# EAGLE design Xenium2019 (EAGLE 9.6.2)
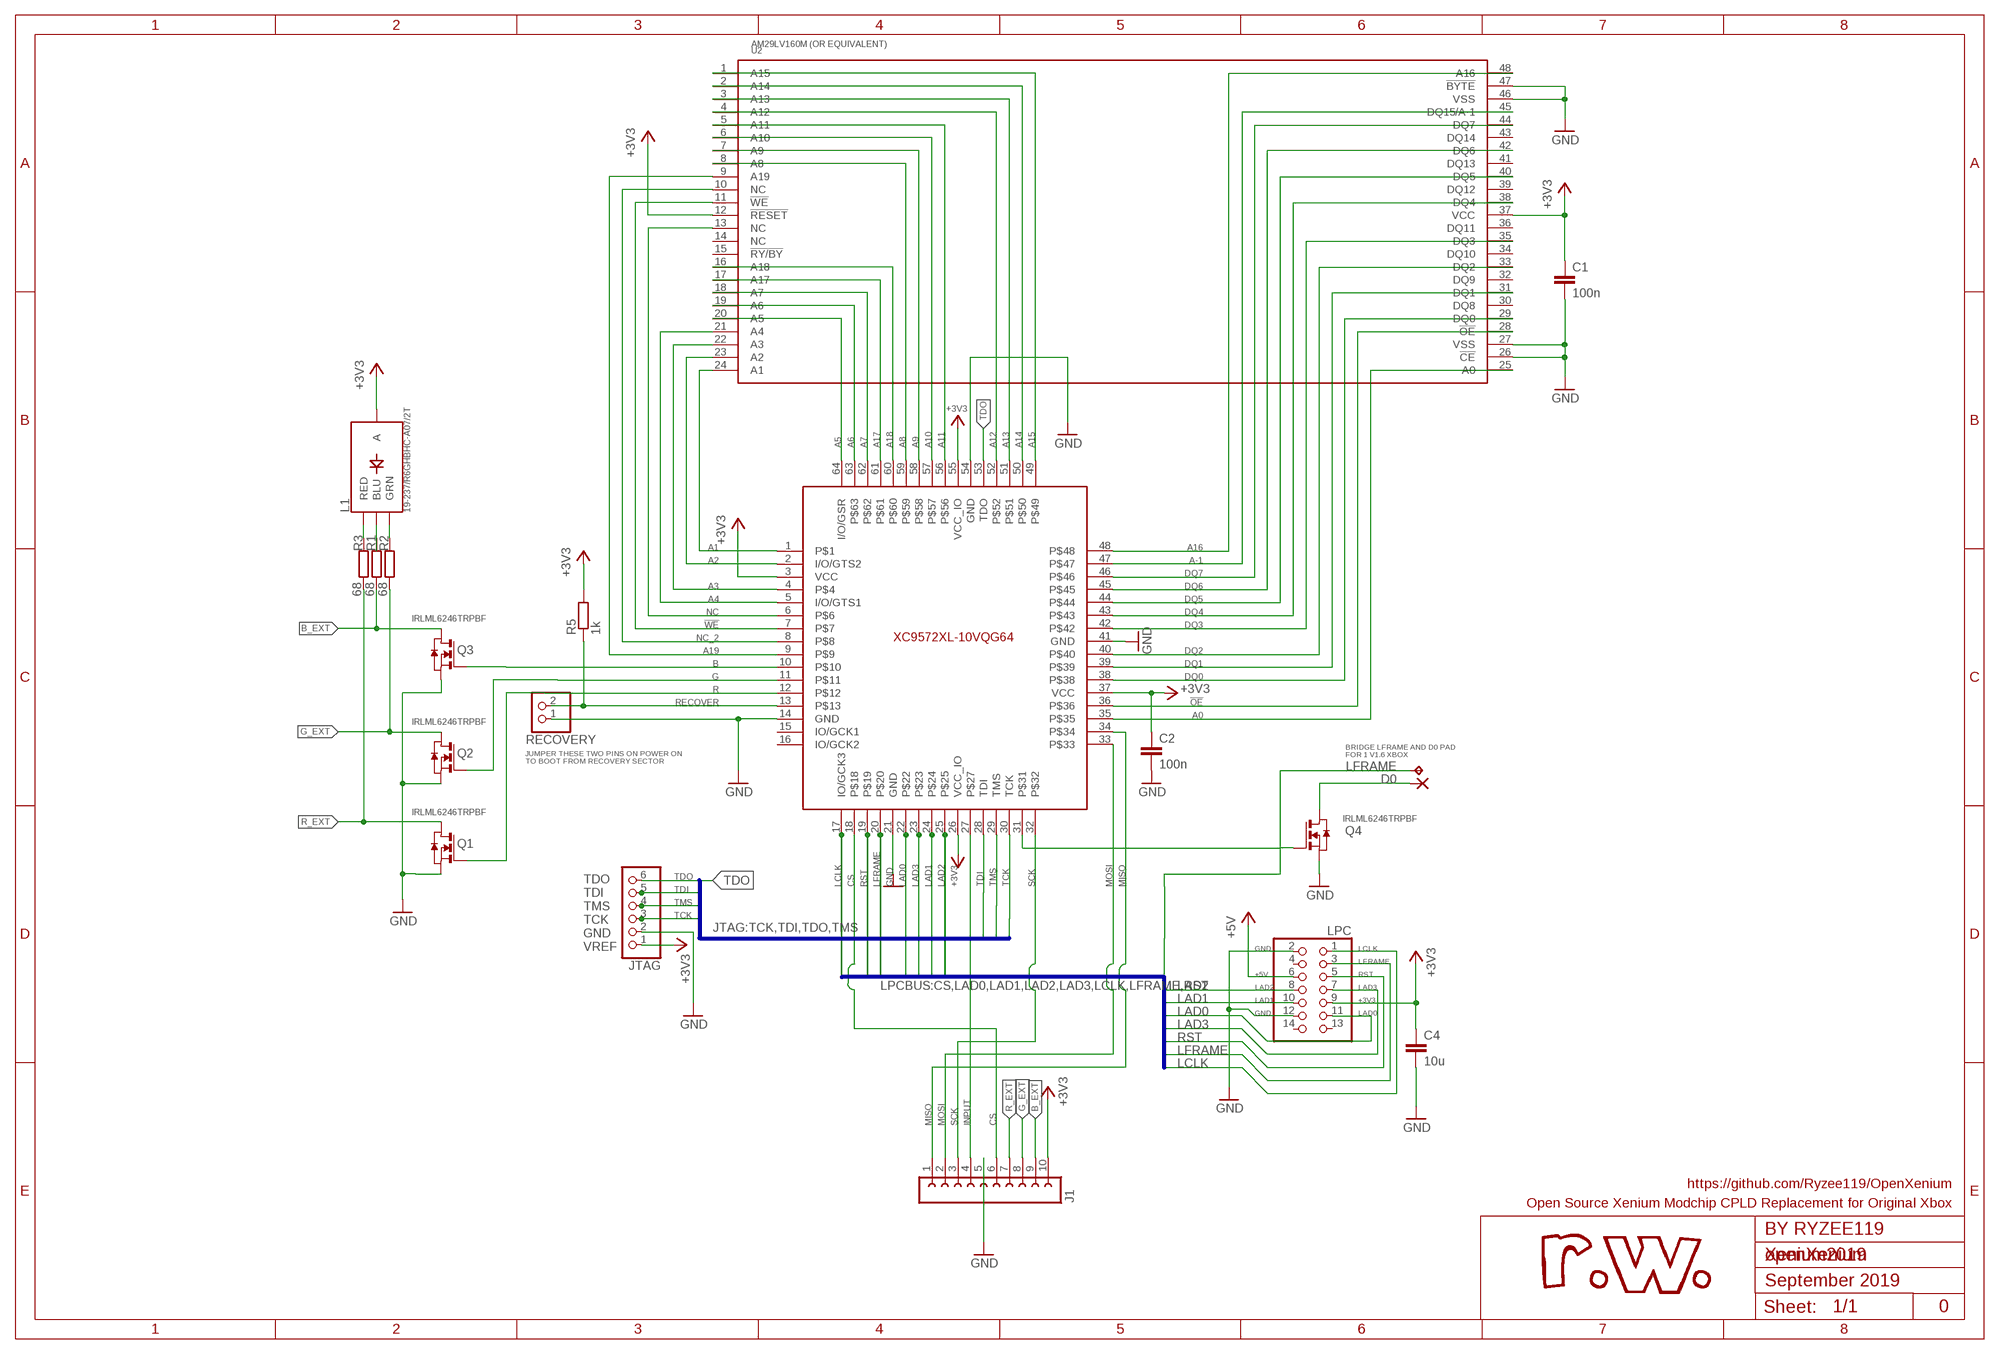
[diagram p0: schematic, sheet 1]

## Parts
C1  100n  C-EUC0603  [C0603]
C2  100n  C-EUC0603  [C0603]
C4  10u  C-EUC0603  [C0603]
D0  SMD2  [SMD1,27-2,54]
J1  FE10-1  [FE10]
JTAG  PINHD-1X6  [1X06]
L1  19-237/R6GHBHC-A07/2T  [4-SMD-R6GHBHC]
LPC  PINHD-2X7  [2X07]
Q1  310mA/60V/1.6Ω  NMOSSOT23  [SOT-23]
Q2  310mA/60V/1.6Ω  NMOSSOT23  [SOT-23]
Q3  310mA/60V/1.6Ω  NMOSSOT23  [SOT-23]
Q4  310mA/60V/1.6Ω  NMOSSOT23  [SOT-23]
R1  68  R-EU_R0603  [R0603]
R2  68  R-EU_R0603  [R0603]
R3  68  R-EU_R0603  [R0603]
R5  1k  R-EU_R0603  [R0603]
RECOVERY  PINHD-1X2  [1X02]
TP1  TPTP13SQ  [TP13SQ]
U1  XC9572XL-10VQG64  [LQFP64]
U2  AM29LV160M  [TSOP48]

## Nets
!OE: U1.36 U2.28(!OE)
!WE: U1.7 U2.11(!WE)
+3V3: C1.1 C2.1 C4.1 J1.10 JTAG.1 L1.P$2(A) LPC.9 R5.2 U1.3(VCC) U1.26(VCC_IO) U1.37(VCC) U1.55(VCC_IO) U2.12(!RESET) U2.37(VCC)
+5V: LPC.6
A0: U1.35 U2.25(A0)
A1: U1.1 U2.24(A1)
A2: U1.2(I/O/GTS2) U2.23(A2)
A3: U1.4 U2.22(A3)
A4: U1.5(I/O/GTS1) U2.21(A4)
A5: U1.64(I/O/GSR) U2.20(A5)
A6: U1.63 U2.19(A6)
A7: U1.62 U2.18(A7)
A8: U1.59 U2.8(A8)
A9: U1.58 U2.7(A9)
A10: U1.57 U2.6(A10)
A11: U1.56 U2.5(A11)
A12: U1.52 U2.4(A12)
A13: U1.51 U2.3(A13)
A14: U1.50 U2.2(A14)
A15: U1.49 U2.1(A15)
A16: U1.48 U2.48(A16)
A17: U1.61 U2.17(A17)
A18: U1.60 U2.16(A18)
A19: U1.9 U2.9(A19)
A-1: U1.47 U2.45(DQ15/A-1)
B: Q3.3(G) U1.10
B_EXT: J1.9 Q3.1(D) R1.2
BLUE: L1.P$4(BLU) R1.1
CS: J1.6 U1.18
DQ0: U1.38 U2.29(DQ0)
DQ1: U1.39 U2.31(DQ1)
DQ2: U1.40 U2.33(DQ2)
DQ3: U1.42 U2.35(DQ3)
DQ4: U1.43 U2.38(DQ4)
DQ5: U1.44 U2.40(DQ5)
DQ6: U1.45 U2.42(DQ6)
DQ7: U1.46 U2.44(DQ7)
G: Q2.3(G) U1.11
G_EXT: J1.8 Q2.1(D) R2.2
GND: C1.2 C2.2 C4.2 J1.5 JTAG.2 LPC.2 LPC.12 Q1.2(S) Q2.2(S) Q3.2(S) Q4.2(S) RECOVERY.1 U1.14(GND) U1.21(GND) U1.41(GND) U1.54(GND) U2.26(!CE) U2.27(VSS) U2.46(VSS) U2.47(!BYTE)
GREEN: L1.P$3(GRN) R2.1
INPUT: J1.4 U1.27
LAD0: LPC.11 U1.22
LAD1: LPC.10 U1.24
LAD2: LPC.8 U1.25
LAD3: LPC.7 U1.23
LCLK: LPC.1 U1.17(IO/GCK3)
LFRAME: LPC.3 TP1.TP U1.20
MISO: J1.1 U1.34
MOSI: J1.2 U1.33
N$37: Q4.3(G) U1.31
N$51: D0.1(P) Q4.1(D)
NC: U1.6 U2.13(NC)
NC_2: U1.8 U2.10(NC)
R: Q1.3(G) U1.12
R_EXT: J1.7 Q1.1(D) R3.2
RECOVER: R5.1 RECOVERY.2 U1.13
RED: L1.P$1(RED) R3.1
RST: LPC.5 U1.19
SCK: J1.3 U1.32
TCK: JTAG.3 U1.30(TCK)
TDI: JTAG.5 U1.28(TDI)
TDO: JTAG.6 U1.53(TDO)
TMS: JTAG.4 U1.29(TMS)
Unconnected: LPC.4 LPC.13 LPC.14 U1.15(IO/GCK1) U1.16(IO/GCK2) U2.14(NC) U2.15(!RY/BY) U2.30(DQ8) U2.32(DQ9) U2.34(DQ10) U2.36(DQ11) U2.39(DQ12) U2.41(DQ13) U2.43(DQ14)

## Buses
JTAG:TCK,TDI,TDO,TMS
LPCBUS:CS,LAD0,LAD1,LAD2,LAD3,LCLK,LFRAME,RST

## Notes on the sheet
- (OR EQUIVALENT)
- IRLML6246TRPBF
- IRLML6246TRPBF
- BRIDGE LFRAME AND D0 PAD
  FOR 1 V1.6 XBOX
- JUMPER THESE TWO PINS ON POWER ON
  TO BOOT FROM RECOVERY SECTOR
- IRLML6246TRPBF
- IRLML6246TRPBF
- TDO
  TDI
  TMS
  TCK
  GND
  VREF
- https://github.com/Ryzee119/OpenXenium
- Open Source Xenium Modchip CPLD Replacement for Original Xbox
- BY RYZEE119
- openXenium
- September 2019
- 0

## Library data of the parts
C1 C2 C4 = rcl:C-EU: CAPACITOR, European symbol; SPICEPREFIX: C
D0 = my-library:SMD2: SMD PAD
J1 = con-lsta:FE10-1: FEMALE HEADER; OC_FARNELL: unknown; OC_NEWARK: unknown
JTAG = pinhead:PINHD-1X6: PIN HEADER
L1 = my-library:19-237/R6GHBHC-A07/2T
LPC = pinhead:PINHD-2X7: PIN HEADER
Q1-Q4 = zetex:NMOSSOT23: MOS FET; OC_FARNELL: unknown; OC_NEWARK: unknown
R1-R3 R5 = rcl:R-EU_: RESISTOR, European symbol; SPICEPREFIX: R
RECOVERY = pinhead:PINHD-1X2: PIN HEADER
TP1 = testpad:TP: Test pad
U1 = my-library:XC9572XL-10VQG64
U2 = my-library:AM29LV160M

## Board
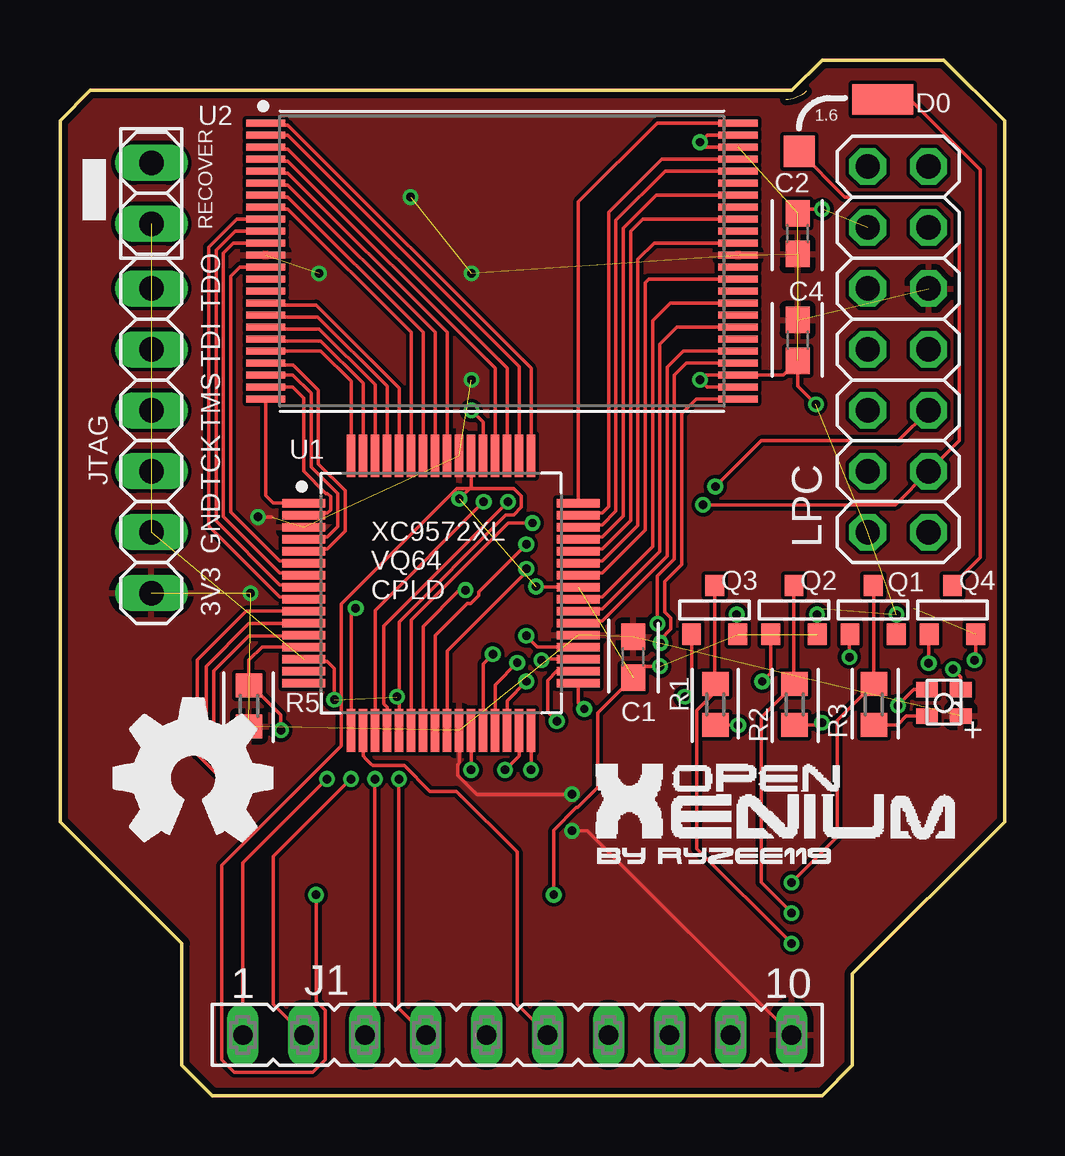
[diagram p1: board, top side]
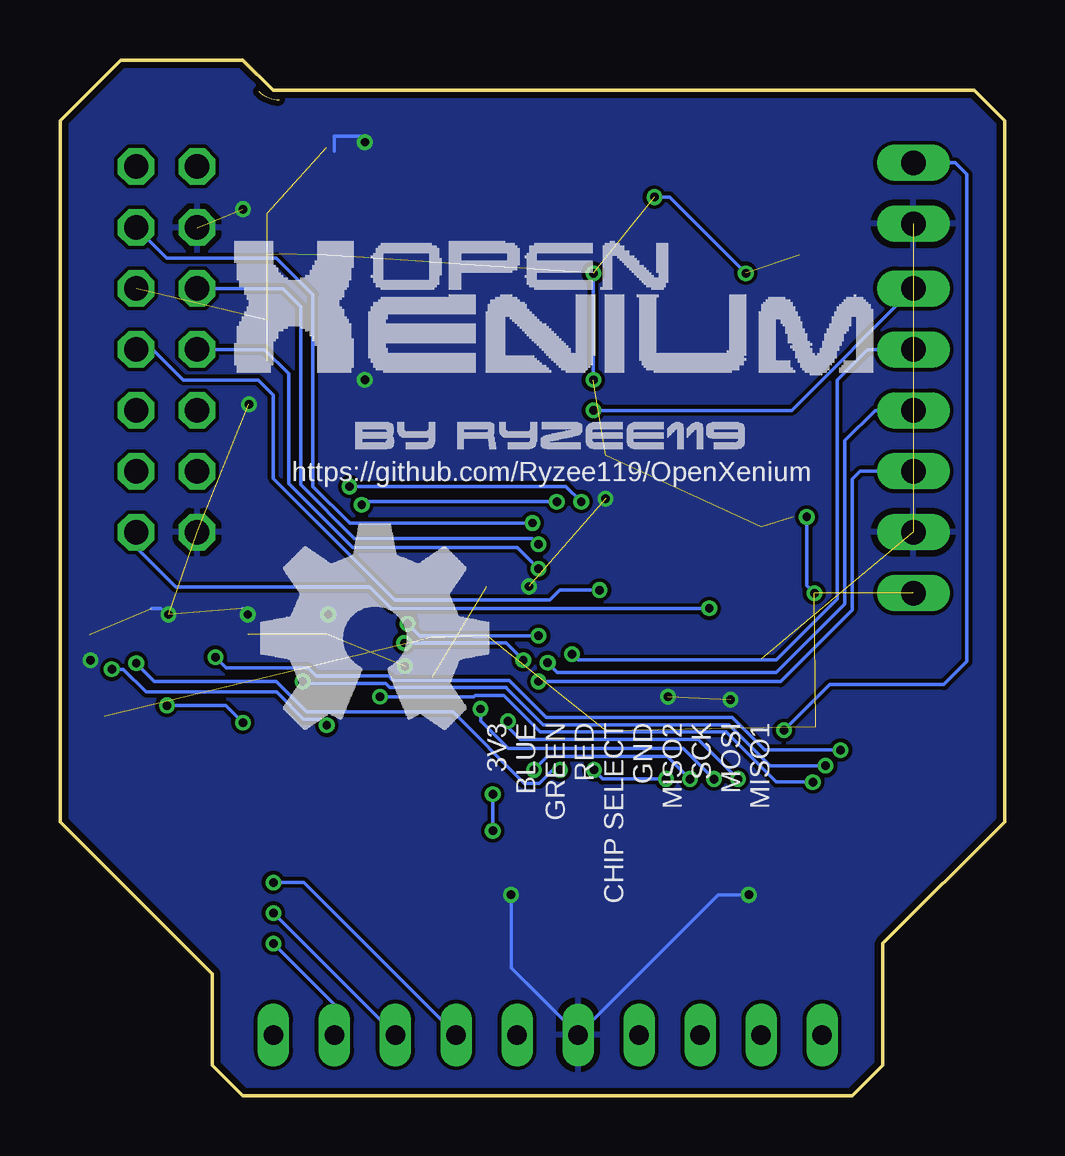
[diagram p2: board, bottom side, seen from below]

Size 39.37 x 43.18 mm. Coordinates in mm from the lower left corner, seen from the top.
Outline: 31.09,41.87 arc-44 30.24,41.53
Outline: 0,40.64 1.27,41.91 30.48,41.91 31.75,43.18 36.83,43.18 39.37,40.64 39.37,11.43 33.02,5.08 33.02,1.27 31.75,0 6.35,0 5.08,1.27 5.08,6.35 0,11.43 0,40.64
Copper layers (1*16): Top 0.035mm / dielectric 1.5mm / Bottom 0.035mm
Design rules "Elecrow_2-layer_eagle_rule": minimum track width 6mil, minimum drill 12mil, track to track 6mil, track to pad 6mil, pad to pad 6mil, via to via 6mil, smd to smd 0mil, copper to edge 10mil, drill to drill 10mil, minimum pad ring 10mil, minimum via ring 6mil, stop-mask expansion 2mil, vias tented up to drill 100mil, thermal gap 10mil

### Footprints (pad centres in the part's own frame; a part is rotated, then mirrored left to right if it is on the bottom)
C0603 = smd 1.1 x 1: 1 -0.85,0; 2 0.85,0
SMD1,27-2,54 = smd 1.27 x 2.54: 1 0,0
FE10 = drill 0.813 long: 1 -11.43,0; 2 -8.89,0; 3 -6.35,0; 4 -3.81,0; 5 -1.27,0; 6 1.27,0; 7 3.81,0; 8 6.35,0; 9 8.89,0; 10 11.43,0
1X06 = drill 1.016 long: 1 -6.35,0; 2 -3.81,0; 3 -1.27,0; 4 1.27,0; 5 3.81,0; 6 6.35,0
4-SMD-R6GHBHC = smd 0.9 x 0.65: P$1 -0.7,-0.55; P$2 0.7,-0.55; P$3 -0.7,0.55; P$4 0.7,0.55
2X07 = drill 1.016 octagon: 1 -7.62,-1.27; 2 -7.62,1.27; 3 -5.08,-1.27; 4 -5.08,1.27; 5 -2.54,-1.27; 6 -2.54,1.27; 7 0,-1.27; 8 0,1.27; 9 2.54,-1.27; 10 2.54,1.27; 11 5.08,-1.27; 12 5.08,1.27; 13 7.62,-1.27; 14 7.62,1.27
SOT-23 = smd 0.787 x 0.889: 1 0.025,-1.016; 2 -0.94,1.016; 3 0.991,1.016
R0603 = smd 1 x 1.1: 1 -0.85,0; 2 0.85,0
1X02 = drill 1.016 long: 1 -1.27,0; 2 1.27,0
TP13SQ = smd 1.3 x 1.3: TP 0,0
LQFP64 = smd 1.788 x 0.363: 1 -5.727,3.75; 2 -5.727,3.25; 3 -5.727,2.75; 4 -5.727,2.25; 5 -5.727,1.75; 6 -5.727,1.25; 7 -5.727,0.75; 8 -5.727,0.25; 9 -5.727,-0.25; 10 -5.727,-0.75; 11 -5.727,-1.25; 12 -5.727,-1.75; 13 -5.727,-2.25; 14 -5.727,-2.75; 15 -5.727,-3.25; 16 -5.727,-3.75; 33 5.727,-3.75; 34 5.727,-3.25; 35 5.727,-2.75; 36 5.727,-2.25; 37 5.727,-1.75; 38 5.727,-1.25; 39 5.727,-0.75; 40 5.727,-0.25; 41 5.727,0.25; 42 5.727,0.75; 43 5.727,1.25; 44 5.727,1.75; 45 5.727,2.25; 46 5.727,2.75; 47 5.727,3.25; 48 5.727,3.75 | smd 0.363 x 1.788: 17 -3.75,-5.727; 18 -3.25,-5.727; 19 -2.75,-5.727; 20 -2.25,-5.727; 21 -1.75,-5.727; 22 -1.25,-5.727; 23 -0.75,-5.727; 24 -0.25,-5.727; 25 0.25,-5.727; 26 0.75,-5.727; 27 1.25,-5.727; 28 1.75,-5.727; 29 2.25,-5.727; 30 2.75,-5.727; 31 3.25,-5.727; 32 3.75,-5.727; 49 3.75,5.727; 50 3.25,5.727; 51 2.75,5.727; 52 2.25,5.727; 53 1.75,5.727; 54 1.25,5.727; 55 0.75,5.727; 56 0.25,5.727; 57 -0.25,5.727; 58 -0.75,5.727; 59 -1.25,5.727; 60 -1.75,5.727; 61 -2.25,5.727; 62 -2.75,5.727; 63 -3.25,5.727; 64 -3.75,5.727
TSOP48 = smd 1.636 x 0.3: 1 -9.839,5.75; 2 -9.839,5.25; 3 -9.839,4.75; 4 -9.839,4.25; 5 -9.839,3.75; 6 -9.839,3.25; 7 -9.839,2.75; 8 -9.839,2.25; 9 -9.839,1.75; 10 -9.839,1.25; 11 -9.839,0.75; 12 -9.839,0.25; 13 -9.839,-0.25; 14 -9.839,-0.75; 15 -9.839,-1.25; 16 -9.839,-1.75; 17 -9.839,-2.25; 18 -9.839,-2.75; 19 -9.839,-3.25; 20 -9.839,-3.75; 21 -9.839,-4.25; 22 -9.839,-4.75; 23 -9.839,-5.25; 24 -9.839,-5.75; 25 9.839,-5.75; 26 9.839,-5.25; 27 9.839,-4.75; 28 9.839,-4.25; 29 9.839,-3.75; 30 9.839,-3.25; 31 9.839,-2.75; 32 9.839,-2.25; 33 9.839,-1.75; 34 9.839,-1.25; 35 9.839,-0.75; 36 9.839,-0.25; 37 9.839,0.25; 38 9.839,0.75; 39 9.839,1.25; 40 9.839,1.75; 41 9.839,2.25; 42 9.839,2.75; 43 9.839,3.25; 44 9.839,3.75; 45 9.839,4.25; 46 9.839,4.75; 47 9.839,5.25; 48 9.839,5.75

### Placement (x,y rotation side)
C1  23.88,18.29 270 top
C2  30.73,35.94 90 top
C4  30.73,31.5 270 top
D0  34.29,41.53 90 top
J1  19.05,2.54 0 top
JTAG  3.81,27.3 90 top
L1  36.83,16.38 0 top
LPC  34.93,31.11 90 top
Q1  33.91,20.26 180 top
Q2  30.61,20.26 180 top
Q3  27.3,20.26 180 top
Q4  37.21,20.26 180 top
R1  27.3,16.32 90 top
R2  30.61,16.32 90 top
R3  33.91,16.32 90 top
R5  7.87,16.26 270 top
RECOVERY  3.81,37.62 90 top
TP1  30.8,39.37 0 top
U1  15.88,20.95 0 top
U2  18.41,34.8 0 top

### Tracks (layer width: path | path; a pad name or v marks a point on that pad's centre or on a via)
!OE  (via drill 0.35)
  Top 0.152: U2.28 26.1,30.55 25.6,30.05 25.6,22.38 24.89,21.66 v24.89,19.68 | U1.36 20.31,18.7 20.3,18.72 19.89,18.72 v19.43,19.18
  Bottom 0.152: v24.89,19.68 24.38,19.18 v19.43,19.18
!WE
  Top 0.152: U1.7 10.06,21.79 9.16,21.79 6.81,24.15 6.81,35.13 7.23,35.55 U2.11
+3V3  (via drill 0.35)  (15 unrouted)
  Top 0.152: 8.82,24.13 v8.26,24.13 | U1.26 16.62,13.88 16.57,13.82 16.57,13.36 17.36,12.57 v21.34,12.57 | v21.34,11.05 21.97,11.05 J1.10 30.48,1.29
  Bottom 0.152: v10.79,34.29 13.97,37.47 v14.61,37.47 | v17.14,29.84 v17.14,34.29 | v8.26,24.13 8.26,21.27 v7.94,20.95 | v21.34,12.57 v21.34,11.05
  pour Top: -1.75,-1.96 -1.75,44.02 40.69,44.02 40.69,-1.96
A0  (via drill 0.35)
  Top 0.152: U2.25 26.51,29.05 25.91,28.45 25.91,22.16 25.2,21.44 25.2,20.17 25.45,19.91 25.45,19.45 25.02,19.03 v25.02,18.88 | v20.07,18.16 20.11,18.2 U1.35
  Bottom 0.152: v25.02,18.88 24.52,18.88 24.51,18.87 20.78,18.87 v20.07,18.16
A1
  Top 0.152: U1.1 8.89,24.7 8.58,25.02 U2.24
A2
  Top 0.152: U1.2 10.24,24.29 11.14,24.29 11.27,24.43 11.27,24.98 11.14,25.11 11.08,25.11 10.16,26.04 10.16,29.08 9.7,29.55 U2.23
A3
  Top 0.152: U1.4 10.24,23.29 11.14,23.29 11.58,23.73 11.58,25.11 10.46,26.22 10.46,29.29 9.7,30.05 U2.22
A4
  Top 0.152: U2.21 8.58,30.47 9.71,30.47 10.77,29.41 10.77,26.34 11.88,25.23 11.88,23.54 11.14,22.79 10.24,22.79 U1.5
A5
  Top 0.152: U1.64 12.12,29.79 10.86,31.05 U2.20
A6
  Top 0.152: U2.19 8.66,31.47 10.87,31.47 12.62,29.72 U1.63
A7
  Top 0.152: U2.18 8.66,31.97 10.8,31.97 13.12,29.65 U1.62
A8
  Top 0.152: U2.8 8.66,36.97 9.49,36.97 14.62,31.83 U1.59
A9
  Top 0.152: U2.7 8.66,37.47 9.49,37.47 15.12,31.83 U1.58
A10
  Top 0.152: U2.6 8.66,37.97 9.49,37.97 15.62,31.83 U1.57
A11
  Top 0.152: U2.5 8.66,38.47 9.49,38.47 16.12,31.83 U1.56
A12
  Top 0.152: U2.4 8.66,38.97 9.49,38.97 18.12,30.33 U1.52
A13
  Top 0.152: U2.3 8.66,39.47 9.49,39.47 18.62,30.33 U1.51
A14
  Top 0.152: U1.50 19.12,30.41 9.48,40.05 U2.2
A15
  Top 0.152: U2.1 8.66,40.47 9.49,40.47 19.62,30.34 U1.49
A16
  Top 0.152: U2.48 24.88,40.55 21.6,37.27 U1.48
A17
  Top 0.152: U2.17 8.66,32.47 10.74,32.47 13.62,29.58 U1.61
A18
  Top 0.152: U2.16 8.66,32.97 10.67,32.97 14.12,29.51 U1.60
A19
  Top 0.152: U1.9 10.06,20.79 9.16,20.79 6.2,23.76 6.2,35.38 7.37,36.55 U2.9
A-1
  Top 0.152: U1.47 21.69,24.29 22.59,24.29 22.86,24.56 22.86,36.83 25.08,39.05 U2.45
B  (via drill 0.35)
  Top 0.152: U1.10 7.76,20.2 5.71,18.16 5.71,14.22 6.86,13.08 v8,13.08 | v26.04,16.64 26.31,16.92 Q3.3
  Bottom 0.152: v8,13.08 9.53,13.08 11.61,15.16 19.36,15.16 20.88,16.68 22.07,16.68 22.12,16.64 v26.04,16.64
B_EXT  (via drill 0.35)
  Top 0.152: Q3.1 27.28,17.4 R1.2 27.3,16.84 26.53,16.06 26.53,12.7 26.53,10.3 v30.48,6.35
  Bottom 0.152: J1.9 27.94,3.81 v30.48,6.35
BLUE  (via drill 0.35)
  Top 0.152: v37.21,17.78 37.53,17.46 L1.P$4 | v28.26,15.45 28.23,15.47 R1.1
  Bottom 0.152: v37.21,17.78 36.73,17.78 35.78,16.83 30.34,16.83 29.21,15.7 28.51,15.7 v28.26,15.45
CS
  Top 0.152: U1.18 12.62,14.17 12.76,14.03 12.95,13.84 13.03,13.76 14.35,13.76 15.41,12.7 16.51,12.7 19.05,10.16 19.05,3.81 J1.6
DQ0
  Top 0.152: U2.29 25.97,31.05 25.3,30.38 25.3,22.5 22.59,19.79 21.69,19.79 U1.38
DQ1
  Top 0.152: U2.31 25.7,32.05 24.99,31.34 24.99,22.7 22.59,20.29 21.69,20.29 U1.39
DQ2
  Top 0.152: U2.33 25.43,33.05 24.69,32.31 24.69,22.89 22.59,20.79 21.69,20.79 U1.40
DQ3
  Top 0.152: U2.35 24.52,34.05 24.38,33.91 24.38,23.59 22.59,21.79 21.69,21.79 U1.42
DQ4
  Top 0.152: U2.38 24.75,35.55 24.08,34.87 24.08,23.78 22.59,22.29 21.69,22.29 U1.43
DQ5
  Top 0.152: U2.40 24.28,36.55 23.77,36.04 23.77,23.98 22.59,22.79 21.69,22.79 U1.44
DQ6
  Top 0.152: U2.42 24.85,37.55 23.47,36.17 23.47,24.17 22.59,23.29 21.69,23.29 U1.45
DQ7
  Top 0.152: U2.44 25.21,38.55 23.16,36.5 23.16,24.37 22.59,23.79 21.69,23.79 U1.46
G  (via drill 0.35)
  Top 0.152: U1.11 10.13,19.68 7.87,19.68 6.1,17.91 6.1,14.38 6.71,13.76 v7.47,13.76 | v29.26,17.27 29.62,17.63 Q2.3
  Bottom 0.152: v7.47,13.76 9.77,13.76 11.48,15.47 19.23,15.47 20.75,16.99 20.78,17.02 25.63,17.02 25.8,17.19 29.18,17.19 v29.26,17.27
G_EXT  (via drill 0.35)
  Top 0.152: Q2.1 30.58,17.2 R2.2 29.21,15.77 29.21,12.7 29.21,12.12 29.21,8.89 v30.48,7.62
  Bottom 0.152: J1.8 v30.48,7.62
GND  (via drill 0.35)  (14 unrouted)
  Top 0.152: U1.54 17.12,25.38 v16.64,24.89 | U1.14 10.24,18.11 11.14,18.11 11.43,17.82 v11.43,16.51 | U2.26 26.97,29.55 v26.67,29.84 26.87,30.05 U2.27 30.14,30.05 C4.2 30.73,29.59 v31.5,28.83 | U2.46 26.87,39.55 v26.67,39.75 26.97,40.05 U2.47 | v24.99,17.91 24.34,17.91 24.17,17.74 C1.2 22.4,15.96 22.4,12.85 21.57,12.02 21.52,12.02 20.57,11.07 v20.57,8.38 | C2.2 30.9,36.96 v31.75,36.96 | 34.86,19.23 34.79,19.15 | v14.04,16.64 14.12,16.55 U1.21 14.12,19.76 18.57,24.21 18.9,24.21 19.22,24.54 19.22,25 18.9,25.32 16.53,25.32 11.71,20.5 11.71,14.59 6.73,9.6 6.73,1.51 7.25,0.99 10.53,0.99 11.05,1.51 11.05,3.57 10.67,3.95 v10.67,8.38 | U1.41 19.86,21.2 v19.83,21.23 | Q4.2 38.15,18.21 v38.1,18.16 | v34.85,20.07 Q1.2 34.86,19.23 | Q3.2 28.19,19.29 v28.19,20.07 | Q2.2 v31.55,20.07 | 34.86,19.23
  Bottom 0.152: v26.67,39.75 26.67,40.01 27.94,40.01 27.94,39.37 | v34.85,20.07 35.18,20.32 35.56,20.32 | v31.55,20.07 31.75,20.32 | v10.67,8.38 11.94,8.38 J1.5 20.57,5.33 v20.57,8.38
  pour Bottom: -1.68,-1.9 -1.68,43.82 40.59,43.82 40.59,-1.9
GREEN  (via drill 0.35)
  Top 0.152: R2.1 31.66,15.47 v31.75,15.56 | v34.92,16.27 35.58,16.93 L1.P$3
  Bottom 0.152: v31.75,15.56 32.46,16.27 v34.92,16.27
INPUT  (via drill 0.35)
  Top 0.152: 14.12,13.11 v14.12,13.21 14.12,3.66 J1.4 | v17.12,13.59 U1.27
  Bottom 0.152: v14.12,13.21 16.76,13.21 v17.12,13.59
LAD0  (via drill 0.35)
  Top 0.152: U1.22 14.62,19.83 18.67,23.88 v19.68,23.88
  Bottom 0.152: v19.68,23.88 27.3,23.88 28.83,25.4 28.83,33.4 30.35,34.93 34.93,34.93 LPC.11
LAD1  (via drill 0.35)
  Top 0.152: U1.24 15.62,19.05 15.62,19.18 16.97,20.53 17.12,20.53 17.45,20.85 17.45,21 v19.43,22.99
  Bottom 0.152: v19.43,22.99 19.68,23.24 27.1,23.24 29.34,25.48 29.34,32.89 30.1,33.66 LPC.10
LAD2  (via drill 0.35)
  Top 0.152: U1.25 16.12,18.54 19.43,21.84 v19.43,21.97
  Bottom 0.152: v19.43,21.97 20.32,22.86 27.17,22.86 29.84,25.53 29.84,30.1 30.86,31.11 LPC.8
LAD3  (via drill 0.35)
  Top 0.152: U1.23 15.12,19.57 16.64,21.08 v16.89,21.08
  Bottom 0.152: v16.89,21.08 18.55,21.08 18.96,20.68 25.42,20.68 30.48,25.74 30.48,29.21 31.11,29.84 34.23,29.84 35.5,31.11 LPC.7
LCLK  (via drill 0.35)
  Top 0.152: U1.17 12.12,20.13 v12.32,20.32
  Bottom 0.152: v12.32,20.32 25.57,20.32 26.45,21.21 34.54,21.21 36.2,22.86 LPC.1
LFRAME  (via drill 0.35)
  Top 0.152: U1.20 13.62,16.2 13.48,16.34 13.48,19.58 v18.67,24.77 | v26.8,24.64 34.8,24.64 LPC.3 37.47,27.3 37.47,36.83 36.83,37.47 32.7,37.47 TP1.TP
  Bottom 0.152: v18.67,24.77 26.67,24.77 v26.8,24.64
MISO  (via drill 0.35)
  Top 0.152: U1.34 20.7,17.7 20.32,17.32 20.32,16 v20.7,15.62 | 11.12,13.15 v11.12,13.21 7.62,9.71 J1.1
  Bottom 0.152: v11.12,13.21 12.77,14.86 20.19,14.86 20.7,15.37 v20.7,15.62
MOSI  (via drill 0.35)
  Top 0.152: v21.84,16.13 21.6,16.37 U1.33 | v12.12,13.21 8.89,9.98 8.89,3.81 J1.2
  Bottom 0.152: v12.12,13.21 13.39,14.48 20.7,14.48 21.84,15.62 v21.84,16.13
N$37  (via drill 0.35)
  Top 0.152: Q4.3 36.22,19.18 36.2,19.15 v36.2,18.03 | U1.31 19.12,14.17 v18.54,13.59
  Bottom 0.152: v18.54,13.59 18.84,13.59 19.39,13.03 20.02,13.03 22.99,16 29.08,16 30.35,17.27 35.43,17.27 v36.2,18.03
N$51
  Top 0.152: D0.1 35.43,41.53 38.35,38.61 38.35,22.44 Q4.1
NC
  Top 0.152: U1.6 10.06,22.29 9.16,22.29 7.11,24.34 7.11,34.16 7.5,34.55 U2.13
NC_2
  Top 0.152: U1.8 10.06,21.29 9.16,21.29 6.5,23.95 6.5,35.25 7.3,36.05 U2.10
R  (via drill 0.35)
  Top 0.152: U1.12 10.12,19.18 7.87,19.18 6.4,17.7 6.4,14.86 v6.84,14.41 | v32.89,18.29 32.89,19.21 Q1.3
  Bottom 0.152: v6.84,14.41 9.99,14.41 11.36,15.77 19.1,15.77 20.65,17.32 25.5,17.32 25.68,17.5 28.7,17.5 29.03,17.83 32.43,17.83 v32.89,18.29
R_EXT  (via drill 0.35)
  Top 0.152: Q1.1 33.91,21.25 R3.2 32.38,15.65 32.38,10.79 v30.48,8.89
  Bottom 0.152: J1.7 29.21,8.89 v30.48,8.89
RECOVER  (via drill 0.35)
  Top 0.152: v9.21,15.24 9.21,15.88 7.98,17.11 R5.1 7.87,18.16 8.42,18.7 U1.13
  Bottom 0.152: RECOVERY.2 2.06,38.89 1.59,38.42 1.59,18.1 2.54,17.14 7.3,17.14 v9.21,15.24
RED
  Top 0.152: R3.1 34.9,15.47 35.26,15.83 L1.P$1
RST  (via drill 0.35)
  Top 0.152: U1.19 13.12,20.24 v17.65,24.77 | v27.3,25.4 29.21,27.3 34.93,27.3 LPC.5
  Bottom 0.152: v17.65,24.77 18.29,25.4 v27.3,25.4
SCK  (via drill 0.35)
  Top 0.152: 13.12,13.17 v13.12,13.21 13.12,2.96 J1.3 | U1.32 v19.62,13.59
  Bottom 0.152: v13.12,13.21 14.06,14.14 19.07,14.14 v19.62,13.59
TCK  (via drill 0.35)
  Top 0.152: U1.30 18.62,16.47 v19.43,17.27
  Bottom 0.152: JTAG.3 6.03,26.04 6.36,25.7 6.36,20.26 9.35,17.27 v19.43,17.27
TDI  (via drill 0.35)
  Top 0.152: U1.28 17.62,18.01 v18.03,18.41
  Bottom 0.152: v18.03,18.41 17.78,18.16 9.53,18.16 6.98,20.7 6.98,29.84 5.71,31.11 JTAG.5
TDO  (via drill 0.35)
  Top 0.152: v17.14,28.57 17.62,28.09 U1.53
  Bottom 0.152: JTAG.6 8.89,28.57 v17.14,28.57
TMS  (via drill 0.35)
  Top 0.152: U1.29 18.12,17.13 v19.05,18.06
  Bottom 0.152: v19.05,18.06 18.64,17.65 9.53,17.65 6.67,20.51 6.67,27.3 5.4,28.57 JTAG.4

### Text on the board
tPlace: 1.6 | RECOVER | TDO | TDI | TMS | TCK | GND | 3V3 | XC9572XL / VQ64 / CPLD | +
bPlace: https://github.com/Ryzee119/OpenXenium | 3V3 / BLUE / GREEN / RED / CHIP SELECT / GND / MISO2 / SCK / MOSI / MISO1